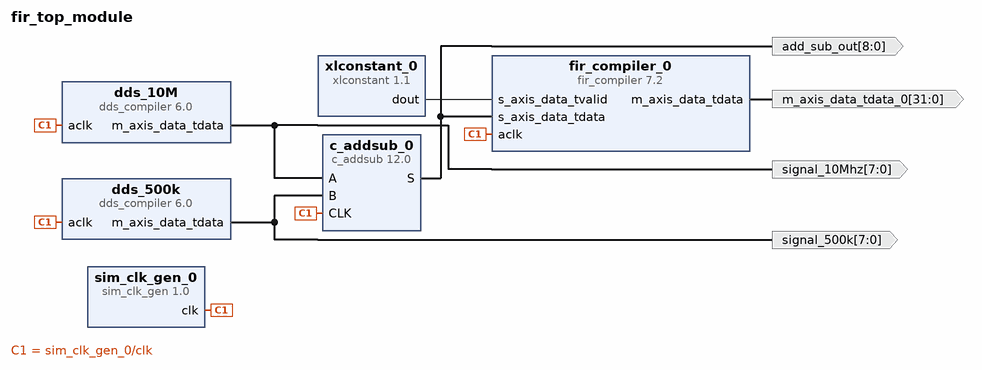
[diagram p0: block diagram of the top level]
# Vivado block design fir_top_module, xc7s50csga324-1, Vivado 2023.1
create_bd_design fir_top_module

create_bd_port -dir O -from 31 -to 0 m_axis_data_tdata_0
create_bd_port -dir O -from 8 -to 0 add_sub_out
create_bd_port -dir O -from 7 -to 0 signal_500k
create_bd_port -dir O -from 7 -to 0 signal_10Mhz

create_bd_cell -type ip -vlnv xilinx.com:ip:dds_compiler:6.0 dds_500k
set_property -dict [list \
  CONFIG.Has_Phase_Out false \
  CONFIG.M_DATA_Has_TUSER Not_Required \
  CONFIG.Output_Frequency1 0.5 \
  CONFIG.Output_Selection Sine \
  CONFIG.PINC1 101000111101011100001 \
] [get_bd_cells dds_500k]
create_bd_cell -type ip -vlnv xilinx.com:ip:dds_compiler:6.0 dds_10M
set_property -dict [list \
  CONFIG.Has_Phase_Out false \
  CONFIG.M_DATA_Has_TUSER Not_Required \
  CONFIG.Output_Frequency1 10 \
  CONFIG.Output_Selection Sine \
  CONFIG.PINC1 1100110011001100110011001 \
] [get_bd_cells dds_10M]
create_bd_cell -type ip -vlnv xilinx.com:ip:sim_clk_gen:1.0 sim_clk_gen_0
create_bd_cell -type ip -vlnv xilinx.com:ip:c_addsub:12.0 c_addsub_0
set_property -dict [list \
  CONFIG.A_Width 8 \
  CONFIG.Add_Mode Add \
  CONFIG.B_Value 00000000 \
  CONFIG.B_Width 8 \
  CONFIG.CE false \
  CONFIG.Latency 1 \
  CONFIG.Out_Width 9 \
] [get_bd_cells c_addsub_0]
create_bd_cell -type ip -vlnv xilinx.com:ip:fir_compiler:7.2 fir_compiler_0
set_property -dict [list \
  CONFIG.Clock_Frequency 100 \
  CONFIG.CoefficientVector {['-477, -92, -80, -51, -4, 63, 151, 259, 387, 533, 693, 863, 1039, 1215, 1386, 1546, 1689, 1810, 1906, 1972, 2005, 2005, 1972, 1906, 1810, 1689, 1546, 1386, 1215, 1039, 863, 693, 533, 387, 259, 151, 63,', '-4, -51, -80, -92, -477']} \
  CONFIG.Coefficient_Fractional_Bits 0 \
  CONFIG.Coefficient_Sets 1 \
  CONFIG.Coefficient_Sign Signed \
  CONFIG.Coefficient_Structure Inferred \
  CONFIG.Coefficient_Width 16 \
  CONFIG.ColumnConfig 21 \
  CONFIG.Data_Width 9 \
  CONFIG.Filter_Architecture Systolic_Multiply_Accumulate \
  CONFIG.Output_Rounding_Mode Full_Precision \
  CONFIG.Output_Width 25 \
  CONFIG.Quantization Integer_Coefficients \
  CONFIG.Sample_Frequency 100 \
] [get_bd_cells fir_compiler_0]
create_bd_cell -type ip -vlnv xilinx.com:ip:xlconstant:1.1 xlconstant_0

# ---- connections ----

connect_bd_net [get_bd_pins c_addsub_0/S] [get_bd_pins fir_compiler_0/s_axis_data_tdata] [get_bd_ports add_sub_out]
connect_bd_net [get_bd_pins dds_10M/m_axis_data_tdata] [get_bd_pins c_addsub_0/A] [get_bd_ports signal_10Mhz]
connect_bd_net [get_bd_pins dds_500k/m_axis_data_tdata] [get_bd_pins c_addsub_0/B] [get_bd_ports signal_500k]
connect_bd_net [get_bd_pins fir_compiler_0/m_axis_data_tdata] [get_bd_ports m_axis_data_tdata_0]
connect_bd_net [get_bd_pins sim_clk_gen_0/clk] \
  [get_bd_pins dds_10M/aclk] [get_bd_pins dds_500k/aclk] [get_bd_pins c_addsub_0/CLK] [get_bd_pins fir_compiler_0/aclk]
connect_bd_net [get_bd_pins xlconstant_0/dout] [get_bd_pins fir_compiler_0/s_axis_data_tvalid]

validate_bd_design
save_bd_design
